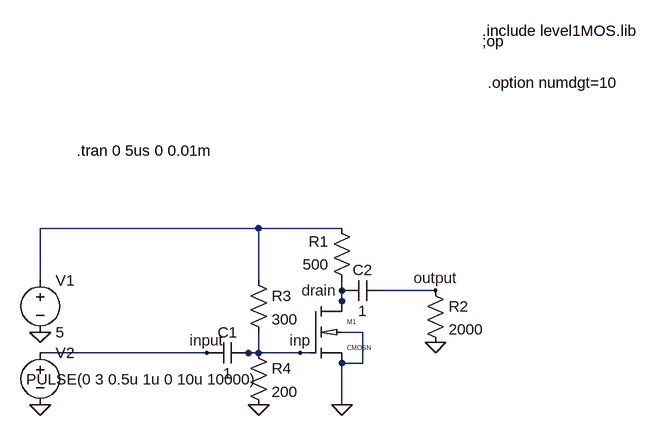
[diagram p0: schematic cmnsrc.asc]
cmnsrc.asc, the LTspice schematic file:
Version 4
SHEET 1 1028 680
WIRE 464 112 128 112
WIRE 592 112 464 112
WIRE 128 192 128 112
WIRE 464 192 464 112
WIRE 592 208 592 192
WIRE 736 208 656 208
WIRE 592 224 592 208
WIRE 592 240 592 224
WIRE 624 272 592 272
WIRE 384 304 128 304
WIRE 448 304 432 304
WIRE 464 304 464 272
WIRE 464 304 448 304
WIRE 528 304 464 304
WIRE 544 304 528 304
WIRE 624 320 624 272
WIRE 624 320 592 320
WIRE 592 384 592 320
FLAG 592 384 0
FLAG 128 272 0
FLAG 464 384 0
FLAG 128 384 0
FLAG 736 288 0
FLAG 528 304 inp
FLAG 592 208 drain
FLAG 384 304 input
FLAG 736 208 output
SYMBOL voltage 128 176 R0
WINDOW 123 0 0 Left 2
WINDOW 39 0 0 Left 2
SYMATTR InstName V1
SYMATTR Value 5
SYMBOL res 448 176 R0
SYMATTR InstName R3
SYMATTR Value 300
SYMBOL res 448 288 R0
SYMATTR InstName R4
SYMATTR Value 200
SYMBOL cmosn 544 224 R0
SYMATTR InstName M1
SYMATTR Value2 l=0.3u w=3u
SYMBOL cap 448 288 R90
WINDOW 0 0 32 VBottom 2
WINDOW 3 32 32 VTop 2
SYMATTR InstName C1
SYMATTR Value 1
SYMBOL voltage 128 288 R0
WINDOW 123 0 0 Left 2
WINDOW 39 0 0 Left 2
WINDOW 3 -22 57 Left 2
SYMATTR Value PULSE(0 3 0.5u 1u 0 10u 10000)
SYMATTR InstName V2
SYMBOL res 608 208 R180
WINDOW 0 36 76 Left 2
WINDOW 3 36 40 Left 2
SYMATTR InstName R1
SYMATTR Value 500
SYMBOL res 720 192 R0
SYMATTR InstName R2
SYMATTR Value 2000
SYMBOL cap 656 192 R90
WINDOW 0 0 32 VBottom 2
WINDOW 3 32 32 VTop 2
SYMATTR InstName C2
SYMATTR Value 1
TEXT 808 -192 Left 2 !.include level1MOS.lib
TEXT 808 -176 Left 2 !;op
TEXT 184 -8 Left 2 !.tran 0 5us 0 0.01m
TEXT 816 -112 Left 2 !.option numdgt=10

The netlist it stands for:
* cmnsrc.asc
V1 N001 0 5
R3 N001 inp 300
R4 inp 0 200
M1 drain inp 0 0 CMOSN l=0.3u w=3u
C1 inp input 1
V2 input 0 PULSE(0 3 0.5u 1u 0 10u 10000)
R1 drain N001 500
R2 output 0 2000
C2 output drain 1
.model NMOS NMOS
.model PMOS PMOS
.lib standard.mos
.include level1MOS.lib
;op
.tran 0 5us 0 0.01m
.option numdgt=10
.lib tsmc018.lib
.backanno
.end